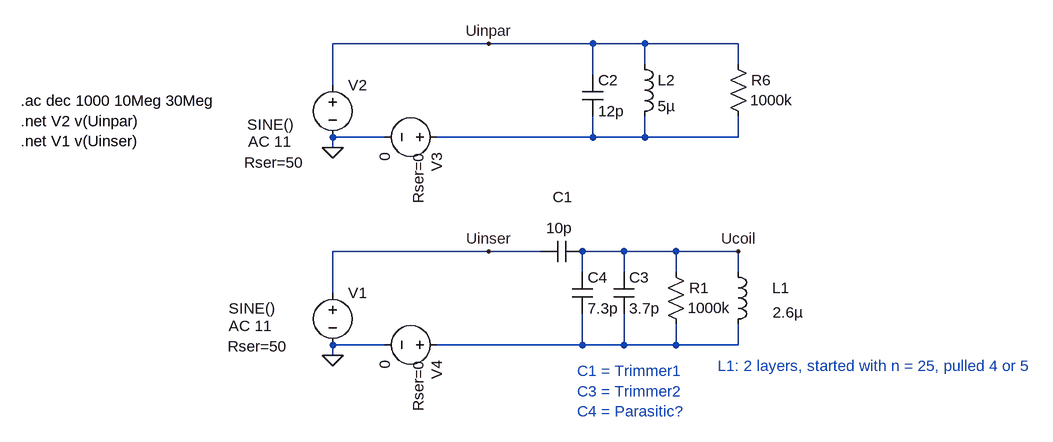
[diagram p0: schematic SeriesRLC-SeriesR-old.asc]
SeriesRLC-SeriesR-old.asc, the LTspice schematic file:
Version 4
SHEET 1 960 680
WIRE 32 -272 -208 -272
WIRE 192 -272 32 -272
WIRE 272 -272 192 -272
WIRE 416 -272 272 -272
WIRE 272 -240 272 -272
WIRE 416 -240 416 -272
WIRE 192 -224 192 -272
WIRE -208 -208 -208 -272
WIRE -128 -128 -208 -128
WIRE 192 -128 192 -160
WIRE 192 -128 -48 -128
WIRE 272 -128 272 -160
WIRE 272 -128 192 -128
WIRE 416 -128 416 -160
WIRE 416 -128 272 -128
WIRE -208 -112 -208 -128
WIRE 32 48 -208 48
WIRE 112 48 32 48
WIRE 240 48 176 48
WIRE 320 48 240 48
WIRE 416 48 320 48
WIRE 176 80 176 48
WIRE 240 80 240 48
WIRE 320 80 320 48
WIRE 416 80 416 48
WIRE -208 112 -208 48
WIRE -128 192 -208 192
WIRE 176 192 176 144
WIRE 176 192 -48 192
WIRE 240 192 240 144
WIRE 240 192 176 192
WIRE 320 192 320 160
WIRE 320 192 240 192
WIRE 416 192 416 160
WIRE 416 192 320 192
WIRE -208 208 -208 192
FLAG -208 208 0
FLAG 416 48 Ucoil
FLAG 32 48 Uinser
FLAG -208 -112 0
FLAG 32 -272 Uinpar
SYMBOL ind 400 64 R0
WINDOW 0 68 40 Left 2
WINDOW 3 69 78 Left 2
SYMATTR InstName L1
SYMATTR Value 2.6µ
SYMATTR SpiceLine Rser=0.08
SYMBOL voltage -208 96 R0
WINDOW 123 -160 67 Left 2
WINDOW 39 -162 98 Left 2
WINDOW 3 -160 40 Left 2
SYMATTR Value2 AC 11
SYMATTR SpiceLine Rser=50
SYMATTR Value SINE()
SYMATTR InstName V1
SYMBOL cap 112 64 R270
WINDOW 0 84 34 VTop 2
WINDOW 3 68 29 VBottom 2
SYMATTR InstName C1
SYMATTR Value 10p
SYMATTR SpiceLine Rser=3
SYMBOL ind 256 -256 R0
SYMATTR InstName L2
SYMATTR Value 5µ
SYMATTR SpiceLine Rser=0.313 Cpar=38f
SYMBOL voltage -208 -224 R0
WINDOW 123 -130 103 Left 2
WINDOW 39 -136 135 Left 2
WINDOW 3 -132 77 Left 2
SYMATTR Value2 AC 11
SYMATTR SpiceLine Rser=50
SYMATTR Value SINE()
SYMATTR InstName V2
SYMBOL cap 176 -224 R0
SYMATTR InstName C2
SYMATTR Value 12p
SYMBOL res 400 -256 R0
WINDOW 3 34 71 Left 2
SYMATTR Value 1000k
SYMATTR InstName R6
SYMBOL voltage -32 -128 R90
WINDOW 123 0 0 Left 2
WINDOW 39 24 44 Left 2
SYMATTR SpiceLine Rser=0
SYMATTR InstName V3
SYMATTR Value 0
SYMBOL voltage -32 192 R90
WINDOW 123 0 0 Left 2
WINDOW 39 24 44 Left 2
SYMATTR SpiceLine Rser=0
SYMATTR InstName V4
SYMATTR Value 0
SYMBOL res 304 64 R0
WINDOW 3 34 71 Left 2
SYMATTR Value 1000k
SYMATTR InstName R1
SYMBOL cap 224 80 R0
SYMATTR InstName C3
SYMATTR Value 3.7p
SYMATTR SpiceLine Rser=3
SYMBOL cap 160 80 R0
SYMATTR InstName C4
SYMATTR Value 7.3p
SYMATTR SpiceLine Rser=0
TEXT -688 -184 Left 2 !.ac dec 1000 10Meg 30Meg\n.net V2 v(Uinpar)\n.net V1 v(Uinser)
TEXT 168 232 Left 2 ;C1 = Trimmer1\nC3 = Trimmer2\nC4 = Parasitic?
TEXT 384 224 Left 2 ;L1: 2 layers, started with n = 25, pulled 4 or 5

The netlist it stands for:
* SeriesRLC-SeriesR-old.asc
L1 Ucoil N002 2.6µ Rser=0.08
V1 Uinser 0 SINE() AC 11 Rser=50
C1 Uinser Ucoil 10p Rser=3
L2 Uinpar N001 5µ Rser=0.313 Cpar=38f
V2 Uinpar 0 SINE() AC 11 Rser=50
C2 Uinpar N001 12p
R6 Uinpar N001 1000k
V3 N001 0 0 Rser=0
V4 N002 0 0 Rser=0
R1 Ucoil N002 1000k
C3 Ucoil N002 3.7p Rser=3
C4 Ucoil N002 7.3p Rser=0
.ac dec 1000 10Meg 30Meg
.net V2 v(Uinpar)
.net V1 v(Uinser)
* C1 = Trimmer1
* C3 = Trimmer2
* C4 = Parasitic?
* L1: 2 layers, started with n = 25, pulled 4 or 5
.backanno
.end